# EAGLE design Mother Board_ver2.0.0_under (EAGLE 9.6.2)
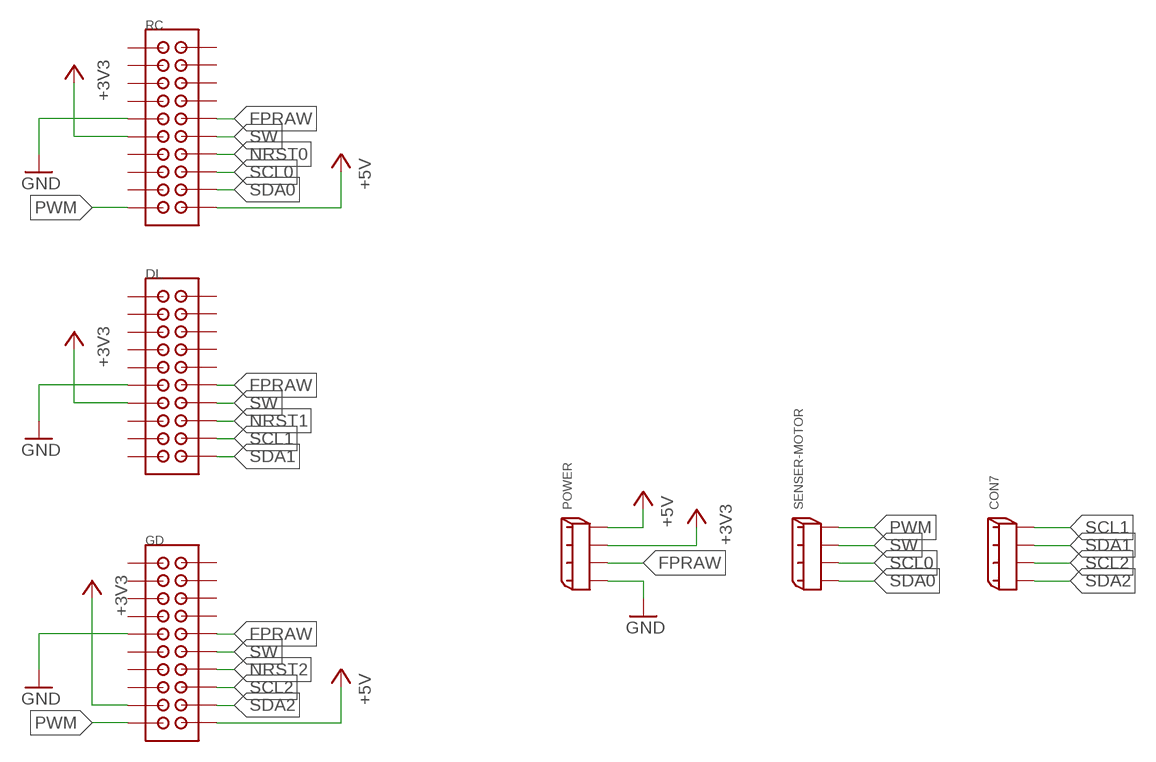
[diagram p0: schematic, sheet 1]

## Parts
CON7  2.5_MINI-SPOX_4PIN  [2.5_MINI-SPOX_4PIN]
DL  2X10  [2X10]
GD  2X10  [2X10]
POWER  2.5_MINI-SPOX_4PIN  [2.5_MINI-SPOX_4PIN]
RC  2X10  [2X10]
SENSER-MOTOR  2.5_MINI-SPOX_4PIN  [2.5_MINI-SPOX_4PIN]

## Nets
+3V3: DL.P$13 GD.P$17 POWER.P$3 RC.P$11
+5V: GD.P$20 POWER.P$4 RC.P$20
FPRAW: DL.P$12 GD.P$10 POWER.P$2 RC.P$10
GND: DL.P$11 GD.P$9 POWER.P$1 RC.P$9
NRST0: RC.P$14
NRST1: DL.P$16
NRST2: GD.P$14
PWM: GD.P$19 RC.P$19 SENSER-MOTOR.P$4
SCL0: RC.P$16 SENSER-MOTOR.P$2
SCL1: CON7.P$4 DL.P$18
SCL2: CON7.P$2 GD.P$16
SDA0: RC.P$18 SENSER-MOTOR.P$1
SDA1: CON7.P$3 DL.P$20
SDA2: CON7.P$1 GD.P$18
SW: DL.P$14 GD.P$12 RC.P$12 SENSER-MOTOR.P$3
Unconnected: DL.P$1 DL.P$2 DL.P$3 DL.P$4 DL.P$5 DL.P$6 DL.P$7 DL.P$8 DL.P$9 DL.P$10 DL.P$15 DL.P$17 DL.P$19 GD.P$1 GD.P$2 GD.P$3 GD.P$4 GD.P$5 GD.P$6 GD.P$7 GD.P$8 GD.P$11 GD.P$13 GD.P$15 RC.P$1 RC.P$2 RC.P$3 RC.P$4 RC.P$5 RC.P$6 RC.P$7 RC.P$8 RC.P$13 RC.P$15 RC.P$17

## Library data of the parts
CON7 POWER SENSER-MOTOR = Connector:2.5_MINI-SPOX_4PIN
DL GD RC = PinSocket:2X10

## Net classes
0 default: width 0.635 mm
1 esp: width 0.635 mm, drill 0.127 mm, clearance 0.025 mm

## Board
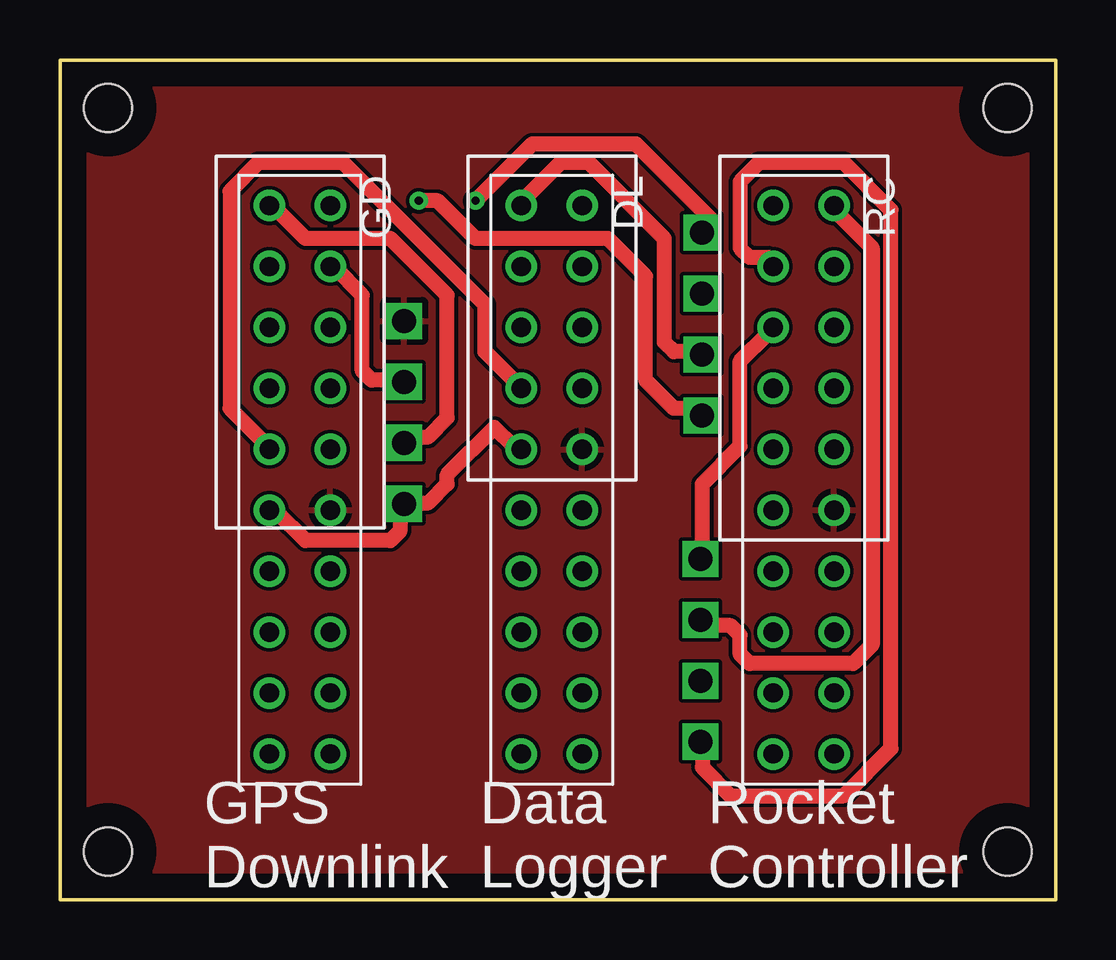
[diagram p1: board, top side]
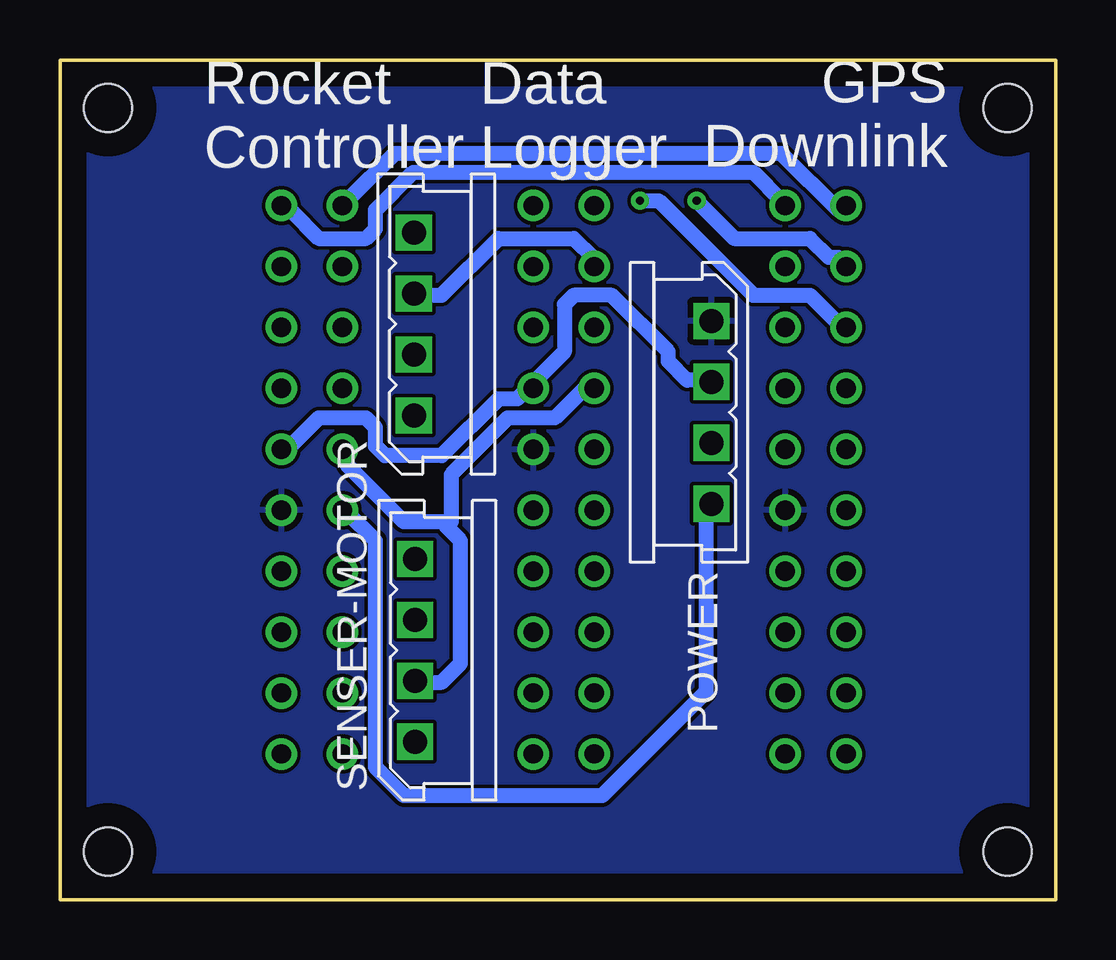
[diagram p2: board, bottom side, seen from below]

Size 41.5 x 35 mm. Coordinates in mm from the lower left corner, seen from the top.
Outline: 0,0 41.5,0 41.5,35 0,35 0,0
Copper layers (1*16): Top 0.035mm / dielectric 1.5mm / Bottom 0.035mm
Design rules "default": minimum track width 6mil, minimum drill 0.35mm, track to track 6mil, track to pad 6mil, pad to pad 6mil, via to via 6mil, smd to smd 6mil, copper to edge 40mil, drill to drill 6mil, minimum pad ring 10mil, minimum via ring 8mil, stop-mask expansion 4mil, vias tented up to drill 0mil, thermal gap 10mil
Holes 2 mm at 2,33 39.5,33 2,2 39.5,2

### Footprints (pad centres in the part's own frame; a part is rotated, then mirrored left to right if it is on the bottom)
2.5_MINI-SPOX_4PIN = drill 1 square: P$1 -1.27,0; P$2 6.35,0; P$3 1.27,0; P$4 3.81,0
2X10 = drill 0.8: P$1 0,1.27; P$2 0,-1.27; P$3 -2.54,1.27; P$4 -2.54,-1.27; P$5 -5.08,1.27; P$6 -5.08,-1.27; P$7 -7.62,1.27; P$8 -7.62,-1.27; P$9 -10.16,1.27; P$10 -10.16,-1.27; P$11 -12.7,1.27; P$12 -12.7,-1.27; P$13 -15.24,1.27; P$14 -15.24,-1.27; P$15 -17.78,1.27; P$16 -17.78,-1.27; P$17 -20.32,1.27; P$18 -20.32,-1.27; P$19 -22.86,1.27; P$20 -22.86,-1.27

### Placement (x,y rotation side)
CON7  26.75,21.45 90 bottom
DL  20.5,6.07 270 top
GD  10,6.07 270 top
POWER  14.35,22.85 270 bottom
RC  31,6.07 270 top
SENSER-MOTOR  26.7,7.85 90 bottom

### Tracks (layer width: path | path; a pad name or v marks a point on that pad's centre or on a via)
+3V3
  Top 0.635: GD.P$17 11.42,26.38 12.6,25.2 12.6,22.05 12.99,21.65 14.17,21.65 POWER.P$3
  Bottom 0.635: POWER.P$3 14.57,21.65 15.35,21.65 16.14,22.44 16.14,22.84 18.5,25.2 20.08,25.2 20.47,24.8 20.47,22.84 21.65,21.65 DL.P$13 22.05,21.26 22.44,20.87 23.23,20.87 25.59,18.5 27.95,18.5 28.35,18.9 28.35,19.68 28.74,20.08 30.71,20.08 31.89,18.9 RC.P$11
+5V
  Top 0.635: GD.P$20 9.05,28.74 10.24,27.56 13.78,27.56 16.14,25.2 16.14,20.08 15.35,19.29 14.57,19.29 POWER.P$4
  Bottom 0.635: RC.P$20 29.53,29.13 27.56,31.1 11.42,31.1 9.05,28.74 GD.P$20
FPRAW
  Top 0.635: GD.P$10 9.05,16.14 10.24,14.96 13.78,14.96 14.17,15.35 14.17,16.14 POWER.P$2 14.57,16.54 15.35,16.54 16.14,17.32 16.14,17.72 18.11,19.68 18.9,18.9 DL.P$12
  Bottom 0.635: RC.P$10 29.53,16.14 28.35,14.96 28.35,5.51 27.16,4.33 18.9,4.33 14.57,8.66 14.57,16.14 POWER.P$2
GND
  pour Top: -3,37 43.5,37 43.5,-1.5 -4,-1.5 -4,37
  pour Bottom: -5,38 45,38 45,-2.5 -5,-2.5
PWM
  Top 0.635: SENSER-MOTOR.P$4 26.77,11.42 27.95,11.42 28.35,11.02 28.35,10.24 28.74,9.84 33.07,9.84 33.86,10.63 33.86,27.16 32.28,28.74 RC.P$19
  Bottom 0.635: GD.P$19 11.42,29.13 12.6,30.32 26.77,30.32 28.35,28.74 28.35,27.95 28.74,27.56 30.71,27.56 31.89,28.74 RC.P$19
SCL0
  Top 0.635: RC.P$16 29.53,23.62 28.35,22.44 28.35,18.9 26.77,17.32 26.77,14.57 SENSER-MOTOR.P$2
SCL1
  Bottom 0.635: DL.P$18 19.29,26.77 20.08,27.56 23.23,27.56 25.59,25.2 26.38,25.2 CON7.P$4
SCL2  (via drill 0.35)
  Top 0.635: v17.32,29.13 19.68,31.5 24.02,31.5 27.16,28.35 27.16,27.95 26.77,27.56 CON7.P$2
  Bottom 0.635: v17.32,29.13 16.54,29.13 12.6,25.2 10.24,25.2 9.05,24.02 GD.P$16
SDA0
  Top 0.635: RC.P$18 29.53,26.77 28.74,26.77 28.35,27.16 28.35,29.92 29.13,30.71 32.68,30.71 34.65,28.74 34.65,6.3 32.68,4.33 27.95,4.33 26.77,5.51 26.77,6.3 SENSER-MOTOR.P$1
SDA1
  Top 0.635: DL.P$20 19.29,29.13 20.87,30.71 22.05,30.71 25.2,27.56 25.2,23.23 25.59,22.84 26.38,22.84 CON7.P$3
SDA2  (via drill 0.35)
  Top 0.635: v14.96,29.13 15.75,29.13 17.32,27.56 22.84,27.56 24.41,25.98 24.41,21.65 25.59,20.47 26.38,20.47 CON7.P$1
  Bottom 0.635: v14.96,29.13 13.39,27.56 10.24,27.56 9.45,26.77 9.05,26.77 GD.P$18
SW
  Top 0.635: GD.P$12 8.66,18.9 7.09,20.47 7.09,29.53 8.27,30.71 11.81,30.71 17.72,24.8 17.72,22.84 18.9,21.65 DL.P$14
  Bottom 0.635: 25.39,15.55 24.8,14.96 24.8,9.84 25.59,9.05 26.38,9.05 SENSER-MOTOR.P$3 | 25.39,15.55 25.59,15.75 27.16,15.75 29.53,18.11 29.53,18.5 RC.P$12 | 25.39,15.55 25.2,15.75 25.2,17.72 22.84,20.08 20.87,20.08 19.29,21.65 DL.P$14

### Text on the board
tPlace: GPS / Downlink | Data / Logger | Rocket / Controller
bPlace: GPS / Downlink | Data / Logger | Rocket / Controller